# Altium schematic sheet schematic.schdoc
size 307 x 218 mm; Symbol: Drawing-Symbol_A4; Device: Drawing-Symbol_A4; Company: 嘉立创EDA; Version: V1.0; Page Size: A4; @Project Name: 微型显示器-401RCT6; @Page Count: 1; @Update Date: 2025-12-23; @Create Date: 2025-12-08; @Schematic Name: Schematic1; @Page No: 1; @Page Name: P1; @Board Name: Board1; @Create Time: 16:00:11; @Update Time: 19:46:00; Title Block Position: 3; Size: A4; Width: 1170; Height: 825; Region Start: 1; X Region Count: 6; Y Region Count: 4; Blade Width: 10
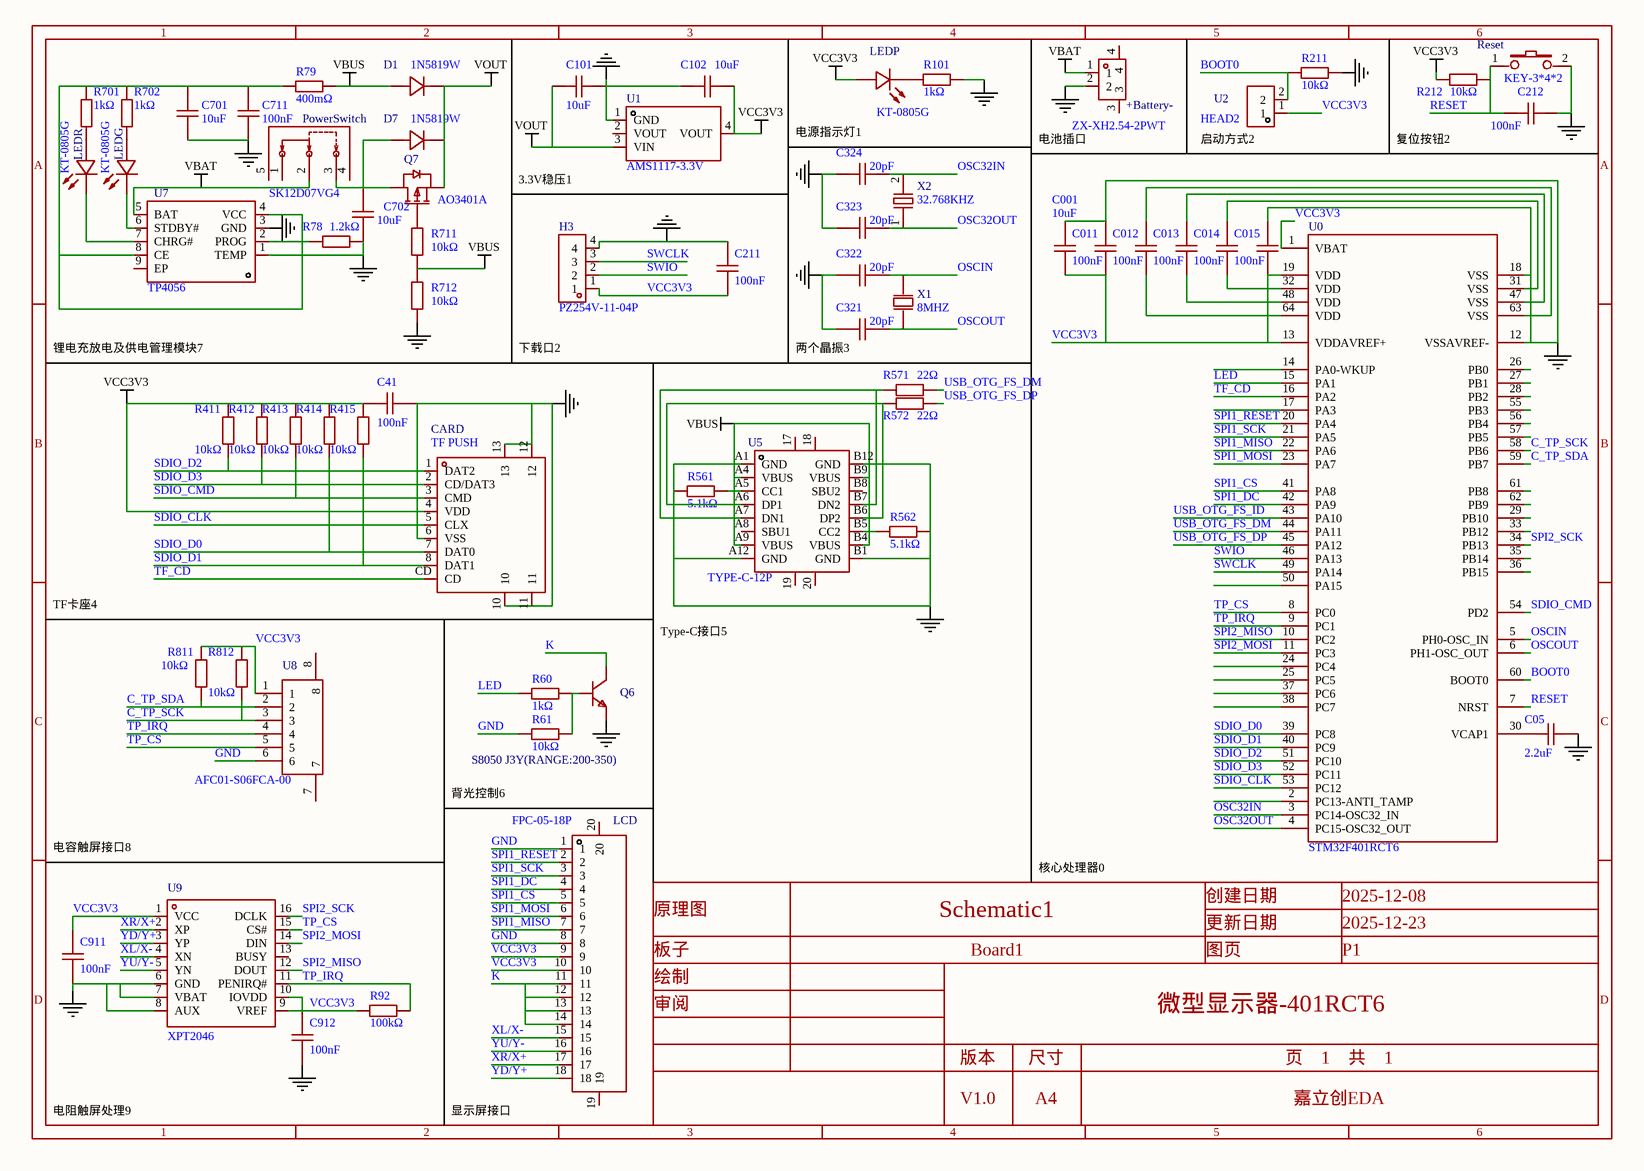
[diagram p0: schematic.schdoc]

## Parts
+Battery-  ZX-XH2.54-2PWT  [CONN-SMD_2P-P2.54_MEGASTAR_ZX-XH2.54-2PWT]
C001  10uF  [C0603]
C05  2.2uF  [C0603]
C011  100nF  [C0603]
C012  100nF  [C0603]
C013  100nF  [C0603]
C014  100nF  [C0603]
C015  100nF  [C0603]
C41  100nF  [C0603]
C101  10uF  [C0603]
C102  10uF  [C0603]
C211  100nF  [C0603]
C212  100nF  [C0603]
C321  20pF  [C0603]
C322  20pF  [C0603]
C323  20pF  [C0603]
C324  20pF  [C0603]
C701  10uF  [C0603]
C702  10uF  [C0603]
C711  100nF  [C0603]
C911  100nF  [C0603]
C912  100nF  [C0603]
CARD  TF PUSH  [TF-SMD_TF-PUSH]
D1  1N5819W  [SOD-123_L2.7-W1.6-LS3.7-FD]
D7  1N5819W  [SOD-123_L2.7-W1.6-LS3.7-FD]
H3  PZ254V-11-04P  [HDR-TH_4P-P2.54-V-M]
LCD  FPC-05-18P  [FPC-SMD_18P-P0.50_XW05200-18]
LEDG  KT-0805G  [LED0805-R-RD]
LEDP  KT-0805G  [LED0805-R-RD]
LEDR  KT-0805G  [LED0805-R-RD]
PowerSwitch  SK12D07VG4  [SW-TH_SK12D07VG4]
Q6  S8050 J3Y(RANGE:200-350)  [SOT-23-3_L3.0-W1.7-P0.95-LS2.9-BR]
Q7  AO3401A  [SOT-23_L2.9-W1.3-P1.90-LS2.4-BR]
R60  1kΩ  [R0603]
R61  10kΩ  [R0603]
R78  1.2kΩ  [R0603]
R79  400mΩ  [R0603]
R92  100kΩ  [R0603]
R101  1kΩ  [R0603]
R211  10kΩ  [R0603]
R212  10kΩ  [R0603]
R411  10kΩ  [R0603]
R412  10kΩ  [R0603]
R413  10kΩ  [R0603]
R414  10kΩ  [R0603]
R415  10kΩ  [R0603]
R561  5.1kΩ  [R0603]
R562  5.1kΩ  [R0603]
R571  22Ω  [R0603]
R572  22Ω  [R0603]
R701  1kΩ  [R0603]
R702  1kΩ  [R0603]
R711  10kΩ  [R0603]
R712  10kΩ  [R0603]
R811  10kΩ  [R0603]
R812  10kΩ  [R0603]
Reset  KEY-3*4*2  [SW-SMD_L4.0-W2.9-LS5.0]
U0  STM32F401RCT6  [LQFP-64_L10.0-W10.0-P0.50-LS12.0-BL]
U1  AMS1117-3.3V  [SOT-223-3_L6.5-W3.4-P2.30-LS7.0-BR]
U2  HEAD2  [HDR-TH_2P-P2.54-V-M]
U5  TYPE-C-12P  [USB-SMD_TYPE-C16PIN]
U7  TP4056  [ESOP-8_L4.9-W3.9-P1.27-LS6.0-BL-EP3.1]
U8  AFC01-S06FCA-00  [FPC-SMD_P0.50-6P_AFC01-S06FCA-00]
U9  XPT2046  [TSSOP-16_L5.0-W4.4-P0.65-LS6.4-BL]
X1  8MHZ  [HC-49S_L11.5-W5.0-P4.88]
X2  32.768KHZ  [CRYSTAL-SMD_L3.2-W1.5-1]

## Nets
GND: +Battery-.2 C001.2 C05.1 C011.2 C012.2 C013.1 C014.2 C015.2 C41.2 C101.2 C102.1 C211.2 C212.2 C321.1 C322.1 C323.1 C324.1 C701.1 C702.1 C711.1 C911.1 C912.1 CARD.6(VSS) CARD.10 CARD.11 CARD.12 CARD.13 H3.4 LCD.1 LCD.8 Q6.2(E) R61.2 R78.2 R101.2 R211.2 R561.1 R562.2 R712.1 Reset.2 U0.12(VSSAVREF-) U0.18(VSS) U0.31(VSS) U0.47(VSS) U0.63(VSS) U1.1(GND) U5.A1(GND) U5.A12(GND) U5.B1(GND) U5.B12(GND) U7.1(TEMP) U7.3(GND) U8.6 U9.6(GND) U9.7(VBAT) U9.8(AUX)
VBAT: +Battery-.1 PowerSwitch.2 U7.5(BAT)
VBUS: D1.2(A) R79.2 R711.1 R712.2 U5.A4(VBUS) U5.A9(VBUS) U5.B4(VBUS) U5.B9(VBUS)
VCC3V3: C001.1 C011.1 C012.1 C013.2 C014.1 C015.1 C41.1 C102.2 C211.1 C911.2 C912.2 CARD.4(VDD) H3.1 LCD.9 LCD.10 LEDP.1(A) R92.2 R212.1 R411.2 R412.2 R413.2 R414.2 R415.2 R811.2 R812.2 U0.1(VBAT) U0.13(VDDAVREF+) U0.19(VDD) U0.32(VDD) U0.48(VDD) U0.64(VDD) U1.4(VOUT) U2.1 U8.1 U9.1(VCC) U9.9(VREF) U9.10(IOVDD)
VOUT: C101.1 D1.1(K) D7.1(K) Q7.2(S) U1.3(VIN)
BOOT0: R211.1 U0.60(BOOT0) U2.2
C_TP_SCK: R812.1 U0.58(PB6) U8.3
C_TP_SDA: R811.1 U0.59(PB7) U8.2
K: LCD.11 LCD.12 LCD.13 LCD.14 Q6.3(C)
LED: R60.2 U0.15(PA1)
OSC32IN: C324.2 U0.3(PC14-OSC32_IN) X2.2
OSC32OUT: C323.2 U0.4(PC15-OSC32_OUT) X2.1
OSCIN: C322.2 U0.5(PH0-OSC_IN) X1.2(OSC2)
OSCOUT: C321.2 U0.6(PH1-OSC_OUT) X1.1(OSC1)
RESET: C212.1 R212.2 Reset.1 U0.7(NRST)
SDIO_CLK: CARD.5(CLX) U0.53(PC12)
SDIO_CMD: CARD.3(CMD) R413.1 U0.54(PD2)
SDIO_D0: CARD.7(DAT0) R414.1 U0.39(PC8)
SDIO_D1: CARD.8(DAT1) R415.1 U0.40(PC9)
SDIO_D2: CARD.1(DAT2) R411.1 U0.51(PC10)
SDIO_D3: CARD.2(CD/DAT3) R412.1 U0.52(PC11)
SPI1_CS: LCD.5 U0.41(PA8)
SPI1_DC: LCD.4 U0.42(PA9)
SPI1_MISO: LCD.7 U0.22(PA6)
SPI1_MOSI: LCD.6 U0.23(PA7)
SPI1_RESET: LCD.2 U0.20(PA4)
SPI1_SCK: LCD.3 U0.21(PA5)
SPI2_MISO: U0.10(PC2) U9.12(DOUT)
SPI2_MOSI: U0.11(PC3) U9.14(DIN)
SPI2_SCK: U0.34(PB13) U9.16(DCLK)
SWCLK: H3.3 U0.49(PA14)
SWIO: H3.2 U0.46(PA13)
TF_CD: CARD.CD U0.16(PA2)
TP_CS: U0.8(PC0) U8.5 U9.15(CS#)
TP_IRQ: R92.1 U0.9(PC1) U8.4 U9.11(PENIRQ#)
USB_OTG_FS_DM: R571.2 U0.44(PA11)
USB_OTG_FS_DP: R572.2 U0.45(PA12)
USB_OTG_FS_ID: U0.43(PA10)
XL/X-: LCD.15 U9.4(XN)
XR/X+: LCD.17 U9.2(XP)
YD/Y+: LCD.18 U9.3(YP)
YU/Y-: LCD.16 U9.5(YN)
NetC05_2: C05.2 U0.30(VCAP1)
NetC701_2: C701.2 C711.2 R79.1 R701.2 R702.2 U7.4(VCC) U7.8(CE)
NetC702_2: C702.2 D7.2(A) PowerSwitch.3 Q7.3(D)
NetLEDG_1: LEDG.1(A) R702.1
NetLEDG_2: LEDG.2(K) U7.6(STDBY#)
NetLEDP_2: LEDP.2(K) R101.1
NetLEDR_1: LEDR.1(A) R701.1
NetLEDR_2: LEDR.2(K) U7.7(CHRG#)
NetQ6_1: Q6.1(B) R60.1 R61.1
NetQ7_1: Q7.1(G) R711.2
NetR78_1: R78.1 U7.2(PROG)
NetR561_2: R561.2 U5.A5(CC1)
NetR562_1: R562.1 U5.B5(CC2)
NetR571_1: R571.1 U5.A7(DN1) U5.B7(DN2)
NetR572_1: R572.1 U5.A6(DP1) U5.B6(DP2)

Not connected (* = marked no-connect by the designer): +Battery- 3 4; LCD 19 20; PowerSwitch 1 4 5; U0 2(PC13-ANTI_TAMP) 14(PA0-WKUP) 17(PA3) 24(PC4) 25(PC5) 26(PB0) 27(PB1) 28(PB2) 29(PB10) 33(PB12) 35(PB14) 36(PB15) 37(PC6) 38(PC7) 50(PA15) 55(PB3) 56(PB4) 57(PB5) 61(PB8) 62(PB9); U1 2(VOUT); U5 17 18 19 20 A8(SBU1) B8(SBU2); U7 9(EP); U8 7 8; U9 13(BUSY)

## Notes on the sheet
- (near C324) 电源指示灯1
- (near +Battery-) 电池插口
- (near U2) 启动方式2
- 复位按钮2
- 3.3V稳压1
- 锂电充放电及供电管理模块7
- 下载口2
- (near C321) 两个晶振3
- TF卡座4
- Type-C接口5
- 电容触屏接口8
- 背光控制6
- 核心处理器0
- 电阻触屏处理9
- 显示屏接口
- 1
- 2
- 3
- 4
- 5
- 6
- A
- B
- C
- 原理图
- Schematic1
- 创建日期
- 更新日期
- 2025-12-08
- 2025-12-23
- 板子
- 绘制
- Board1
- 图页
- P1
- D
- 审阅
- 版本
- 尺寸
- 微型显示器-401RCT6
- 页    1    共    1
- V1.0
- A4
- 嘉立创EDA

## Library data of the parts
+Battery- = ZX-XH2.54-2PWT: Manufacturer: Megastar(兆星); Add into BOM: yes; Pins Structure: 1x2P; Pitch: 2.5mm; Reference Series: XH; Number of PINs Per Row: 2; Current Rating: 3A; Voltage Rating: 250V; Supplementary Features: 辅助焊脚; Z-Height of the Board: 6.2mm; X-Length of Bottom Edge on Board (Spacing Line): 10mm; Y-Width of Bottom Edge on Board: 10.5mm; Symbol: ZX-XH2.54-2PWT; Device: ZX-XH2.54-2PWT; LCSC Part Name: 1x2P 间距:2.5mm 卧贴 系列:XH; Supplier Part: C7429671; Manufacturer Part: ZX-XH2.54-2PWT; Supplier Footprint: SMD,P=2.5mm,卧贴; JLCPCB Part Class: 扩展库; Datasheet: https://item.szlcsc.com/datasheet/ZX-XH2.54-2PWT/8427588.html; Supplier: LCSC; Convert to PCB: yes; Mounting Type: 卧贴; Number of Pins: 2P; Number of Rows: 1; Row Spacing: -; Contact Material: 黄铜; Contact Plating: 锡; Operating Temperature: -25℃~+85℃; Plastic Material: -; Flame Retardant Rating: -; Color: 米色
C001 C701 = CGA0603X5R106K100JT: Manufacturer: HRE(芯声); Symbol: Capacitance; Add into BOM: yes; Tolerance: ±10%; Voltage Rating: 10V; Temperature Coefficient: X5R; Channel ID: $1e1874; Device: CGA0603X5R106K100JT; LCSC Part Name: 10uF ±10% 10V; Supplier Part: C6119842; Manufacturer Part: CGA0603X5R106K100JT; Supplier Footprint: 0603; JLCPCB Part Class: Extended Part; Supplier: LCSC; Convert to PCB: yes; Value: 10uF; FootprintName: C0603; DeviceName: CGA0603X5R106K100JT
C05 = CL10A225KO8NNNC: Manufacturer: SAMSUNG(三星); Symbol: Capacitance; Add into BOM: yes; Tolerance: ±10%; Voltage Rating: 16V; Temperature Coefficient: X5R; Device: CL10A225KO8NNNC; LCSC Part Name: 2.2uF ±10% 16V; Supplier Part: C23630; Manufacturer Part: CL10A225KO8NNNC; Supplier Footprint: 0603; JLCPCB Part Class: Basic Part; Datasheet: https://item.szlcsc.com/datasheet/CL10A225KO8NNNC/24366.html; Supplier: LCSC; Convert to PCB: yes; Value: 2.2uF
C011 C012 C013 C014 C015 C41 C211 C212 C711 C911 C912 = CGA0603X7R104K500JT: Manufacturer: HRE(芯声); Symbol: Capacitance; Add into BOM: yes; Tolerance: ±10%; Voltage Rating: 50V; Temperature Coefficient: X7R; Device: CGA0603X7R104K500JT; LCSC Part Name: 100nF ±10% 50V; Supplier Part: C6119867; Manufacturer Part: CGA0603X7R104K500JT; Supplier Footprint: 0603; JLCPCB Part Class: Extended Part; Datasheet: https://atta.szlcsc.com/upload/public/pdf/source/20250103/C44077DA9E7B3EFAE02F22B6D3D1CBC9.pdf; Supplier: LCSC; Convert to PCB: yes; Value: 100nF
C101 = CGA0603X5R106K100JT: Manufacturer: HRE(芯声); Symbol: Capacitance; Add into BOM: yes; Tolerance: ±10%; Voltage Rating: 10V; Temperature Coefficient: X5R; Channel ID: $1e4207; Device: CGA0603X5R106K100JT; LCSC Part Name: 10uF ±10% 10V; Supplier Part: C6119842; Manufacturer Part: CGA0603X5R106K100JT; Supplier Footprint: 0603; JLCPCB Part Class: Extended Part; Supplier: LCSC; Convert to PCB: yes; Value: 10uF; FootprintName: C0603; DeviceName: CGA0603X5R106K100JT
C102 = CGA0603X5R106K100JT: Manufacturer: HRE(芯声); Symbol: Capacitance; Add into BOM: yes; Tolerance: ±10%; Voltage Rating: 10V; Temperature Coefficient: X5R; Channel ID: $1e4183; Device: CGA0603X5R106K100JT; LCSC Part Name: 10uF ±10% 10V; Supplier Part: C6119842; Manufacturer Part: CGA0603X5R106K100JT; Supplier Footprint: 0603; JLCPCB Part Class: Extended Part; Supplier: LCSC; Convert to PCB: yes; Value: 10uF; FootprintName: C0603; DeviceName: CGA0603X5R106K100JT
C321 = CC0603JRNPO9BN200: Manufacturer: YAGEO(国巨); Symbol: Capacitance; Add into BOM: yes; Tolerance: ±5%; Voltage Rated: 50V; Temperature Coefficient: NP0; Channel ID: $1e6628; Device: CC0603JRNPO9BN200; LCSC Part Name: 20pF ±5% 50V; Supplier Part: C105621; Manufacturer Part: CC0603JRNPO9BN200; Supplier Footprint: 0603; JLCPCB Part Class: Extended Part; Datasheet: https://atta.szlcsc.com/upload/public/pdf/source/20170505/1493957838062.pdf; Supplier: LCSC; Convert to PCB: yes; Value: 20pF; FootprintName: C0603; DeviceName: CC0603JRNPO9BN200
C322 = CC0603JRNPO9BN200: Manufacturer: YAGEO(国巨); Symbol: Capacitance; Add into BOM: yes; Tolerance: ±5%; Voltage Rated: 50V; Temperature Coefficient: NP0; Channel ID: $1e6574; Device: CC0603JRNPO9BN200; LCSC Part Name: 20pF ±5% 50V; Supplier Part: C105621; Manufacturer Part: CC0603JRNPO9BN200; Supplier Footprint: 0603; JLCPCB Part Class: Extended Part; Datasheet: https://atta.szlcsc.com/upload/public/pdf/source/20170505/1493957838062.pdf; Supplier: LCSC; Convert to PCB: yes; Value: 20pF; FootprintName: C0603; DeviceName: CC0603JRNPO9BN200
C323 = CC0603JRNPO9BN200: Manufacturer: YAGEO(国巨); Symbol: Capacitance; Add into BOM: yes; Tolerance: ±5%; Voltage Rated: 50V; Temperature Coefficient: NP0; Channel ID: $1e6277; Device: CC0603JRNPO9BN200; LCSC Part Name: 20pF ±5% 50V; Supplier Part: C105621; Manufacturer Part: CC0603JRNPO9BN200; Supplier Footprint: 0603; JLCPCB Part Class: Extended Part; Datasheet: https://atta.szlcsc.com/upload/public/pdf/source/20170505/1493957838062.pdf; Supplier: LCSC; Convert to PCB: yes; Value: 20pF; FootprintName: C0603; DeviceName: CC0603JRNPO9BN200
C324 = CC0603JRNPO9BN200: Manufacturer: YAGEO(国巨); Symbol: Capacitance; Add into BOM: yes; Tolerance: ±5%; Voltage Rated: 50V; Temperature Coefficient: NP0; Channel ID: $1e6253; Device: CC0603JRNPO9BN200; LCSC Part Name: 20pF ±5% 50V; Supplier Part: C105621; Manufacturer Part: CC0603JRNPO9BN200; Supplier Footprint: 0603; JLCPCB Part Class: Extended Part; Datasheet: https://atta.szlcsc.com/upload/public/pdf/source/20170505/1493957838062.pdf; Supplier: LCSC; Convert to PCB: yes; Value: 20pF; FootprintName: C0603; DeviceName: CC0603JRNPO9BN200
C702 = CGA0603X5R106K100JT: Manufacturer: HRE(芯声); Symbol: Capacitance; Add into BOM: yes; Tolerance: ±10%; Voltage Rating: 10V; Temperature Coefficient: X5R; Channel ID: $1e1609; Device: CGA0603X5R106K100JT; LCSC Part Name: 10uF ±10% 10V; Supplier Part: C6119842; Manufacturer Part: CGA0603X5R106K100JT; Supplier Footprint: 0603; JLCPCB Part Class: Extended Part; Supplier: LCSC; Convert to PCB: yes; Value: 10uF; FootprintName: C0603; DeviceName: CGA0603X5R106K100JT
CARD = TF PUSH: Manufacturer: SHOU HAN(首韩); Add into BOM: yes; Card Connection Mode: 自弹式; Card Type: MicroSD卡(TF卡); Connector Type: 卡座; Additional Card Detection Pins: 无; Symbol: TF PUSH; Device: TF PUSH; LCSC Part Name: 自弹式 MicroSD卡(TF卡) 卡座; Supplier Part: C393941; Manufacturer Part: TF PUSH; Supplier Footprint: SMD; JLCPCB Part Class: 扩展库; Datasheet: https://item.szlcsc.com/datasheet/TF%2520PUSH/372553.html; Supplier: LCSC; Convert to PCB: yes; Supplementary Features: -; Height Above Board: 2mm; Operating Temperature: -25℃~+90℃
D1 D7 = 1N5819W_C5451628: Manufacturer: HXY MOSFET(华轩阳电子); Symbol: 1N4007_C9900004759; Add into BOM: yes; Diode Configuration: 独立式; Voltage - Forward(Vf@If): 600mV@200mA; Voltage - DC Reverse(Vr): 40V; Current - Rectified: 350mA; Reverse Leakage Current (Ir): 5uA@30V; Device: 1N5819W_C5451628; LCSC Part Name: 电压:40V 电流:350mA; Supplier Part: C5451628; Manufacturer Part: 1N5819W; Supplier Footprint: SOD-123; JLCPCB Part Class: Extended Part; Datasheet: https://item.szlcsc.com/datasheet/1N5819W/6355371.html; Supplier: LCSC; Convert to PCB: yes
H3 = PZ254V-11-04P_C492403: Manufacturer: XFCN(兴飞); Add into BOM: yes; Pin Structure: 1x4P; Pitch: 2.54mm; Circluar Pins/Square Pins: 方针; Symbol: PZ254V-11-04P; Device: PZ254V-11-04P_C492403; LCSC Part Name: 1x4P 间距:2.54mm 方针 直插; Supplier Part: C492403; Manufacturer Part: PZ254V-11-04P; Supplier Footprint: 插件,P=2.54mm; JLCPCB Part Class: Extended Part; Datasheet: https://atta.szlcsc.com/upload/public/pdf/source/20200309/C492403_F9F19131791D08044AD4F84F8E751A34.pdf; Supplier: LCSC; Convert to PCB: yes; Row Spacing: -; Mounting Type: 直插; Number of Rows: 单排; Number of Pins: 4P; Current Rating: -; Voltage Rating (Max): -; Length of Mating Pin: 6mm; Insulation Height: 2.5mm; Length of End Connection Pin: 3mm; Contact Material: 黄铜; Contact Plating: -; Operating Temperature: -40℃~+105℃; Color: 黑色
LCD = FPC-05-18P: Add into BOM: yes; Symbol: FPC-05-18P; Device: FPC-05-18P; LCSC Part Name: FPC-05-18P; Supplier Part: C9900014287; Manufacturer Part: FPC-05-18P; Supplier Footprint: FPC-05-18P; JLCPCB Part Class: Extended Part; Supplier: LCSC; Convert to PCB: yes
LEDG LEDP LEDR = KT-0805G: Manufacturer: KENTO; Symbol: 0805G (Green); Add into BOM: yes; Illumination Color: 翠绿色; Voltage - Forward(Vf): 2.6V~3.1V; Power(Watts): 100mW; Forward Current: 5mA; Wavelength - Dominant: 513nm~528nm; Peak Wavelength: 525nm; Luminous Intensity: 430mcd; Viewing Angle: 120°; Device: KT-0805G; LCSC Part Name: 0805 翠绿 高亮; Supplier Part: C2297; Manufacturer Part: KT-0805G; Supplier Footprint: 0805; JLCPCB Part Class: 基础库; Datasheet: https://item.szlcsc.com/datasheet/KT-0805G/2670.html; Supplier: LCSC; Convert to PCB: yes; Lamp Holder Type: -; Diode Configuration: -; Lens Color: -; Color Temperature: -; Mounting Style: -; Operating Temperature: -40℃~+85℃
PowerSwitch = SK12D07VG4: Manufacturer: SHOU HAN(首韩); Add into BOM: yes; Circuit: 单刀双掷; Actuator Style: 矩形柱状; Switch Height: 8.8mm; Current Rating: 500mA; Voltage Rating: 50V; Life: 5千次; Channel ID: $1e20535; Symbol: SK12D07VG4; Device: SK12D07VG4; LCSC Part Name: 3脚2档位 卧插 滑动开关; Supplier Part: C393937; Manufacturer Part: SK12D07VG4; Supplier Footprint: 插件; JLCPCB Part Class: 扩展库; Datasheet: https://item.szlcsc.com/datasheet/SK12D07VG4/372549.html; Supplier: LCSC; Convert to PCB: yes; Termination Style: PC引脚; Mounting Type: -; Operating Temperature: -; Length: 8.7mm; FootprintName: SW-TH_SK12D07VG4; DeviceName: SK12D07VG4
Q6 = S8050 J3Y(RANGE:200-350): Manufacturer: CJ(江苏长电/长晶); Symbol: S8050_C2146; Add into BOM: yes; type: NPN; Current - Collector(Ic): 500mA; Collector - Emitter Voltage VCEO: 25V; Pd - Power Dissipation: 300mW; DC Current Gain: 200@500mA,1V; Transition frequency(fT): 150MHz; Current - Collector Cutoff: 100nA; Vce Saturation(VCE(sat)): 600mV@500mA,50mA; Emitter-Base Voltage(Vebo): 5V; Number: 1个NPN; Device: S8050 J3Y(RANGE:200-350); LCSC Part Name: H档(200-350) NPN 电流:0.5A 电压:25V; Supplier Part: C2146; Manufacturer Part: S8050 J3Y(RANGE:200-350); Supplier Footprint: SOT-23; JLCPCB Part Class: 基础库; Datasheet: https://item.szlcsc.com/datasheet/S8050%2520J3Y(RANGE%253A200-350)/2503.html; Supplier: LCSC; Convert to PCB: yes; Operating Temperature: -55℃~+150℃
Q7 = AO3401A_C347476: Manufacturer: UMW(友台半导体); Add into BOM: yes; Number: 1个P沟道; Drain to Source Voltage: 30V; Current - Continuous Drain(Id): 4.2A; RDS(on): 50mΩ@10V; Pd - Power Dissipation: 1.4W; Gate Threshold Voltage (Vgs(th)): 1.3V@250uA; Gate Charge(Qg): 9.4nC@4.5V; Input Capacitance(Ciss): 954pF; Reverse Transfer Capacitance (Crss@Vds): 77pF; Type: P沟道; Output Capacitance(Coss): 115pF; Symbol: AO3401A_C347476; Device: AO3401A_C347476; LCSC Part Name: 1个P沟道 耐压:30V 电流:4.2A; Supplier Part: C347476; Manufacturer Part: AO3401A; Supplier Footprint: SOT-23; JLCPCB Part Class: 扩展库; Datasheet: https://item.szlcsc.com/datasheet/AO3401A/324136.html; Supplier: LCSC; Convert to PCB: yes; Operating Temperature: -55℃~+150℃
R60 R101 = FRC0603F1001TS: Manufacturer: FOJAN(富捷); Symbol: 电阻; Add into BOM: yes; Tolerance: ±1%; Power(Watts): 100mW; Voltage-Supply(Max): 75V; Temperature Coefficient: ±100ppm/℃; Device: FRC0603F1001TS; LCSC Part Name: 1kΩ ±1% 100mW 厚膜电阻; Supplier Part: C2907002; Manufacturer Part: FRC0603F1001TS; Supplier Footprint: 0603; JLCPCB Part Class: Extended Part; Supplier: LCSC; Convert to PCB: yes; Type: 厚膜电阻; Value: 1kΩ; Operating Temperature: -55℃~+155℃
R61 R211 R212 = RCA0310KJLF: Manufacturer: HKR(香港电阻); Symbol: 电阻; Add into BOM: yes; Tolerance: ±5%; Power(Watts): 100mW; Device: RCA0310KJLF; LCSC Part Name: 10kΩ ±5% 100mW; Supplier Part: C22369937; Manufacturer Part: RCA0310KJLF; Supplier Footprint: 0603; JLCPCB Part Class: Extended Part; Datasheet: https://item.szlcsc.com/datasheet/RCA0310KJLF/23848968.html; Supplier: LCSC; Convert to PCB: yes; Value: 10kΩ
R78 = FRC0603J122 TS: Manufacturer: FOJAN(富捷); Symbol: 电阻; Add into BOM: yes; Tolerance: ±5%; Power(Watts): 100mW; Voltage-Supply(Max): 75V; Temperature Coefficient: ±100ppm/℃; Channel ID: $1e1633; Device: FRC0603J122 TS; LCSC Part Name: 1.2kΩ ±5% 100mW 厚膜电阻; Supplier Part: C2907081; Manufacturer Part: FRC0603J122 TS; Supplier Footprint: 0603; JLCPCB Part Class: Extended Part; Supplier: LCSC; Convert to PCB: yes; Type: 厚膜电阻; Value: 1.2kΩ; Operating Temperature: -55℃~+155℃; FootprintName: R0603; DeviceName: FRC0603J122 TS
R79 = FRL0603JR400TS: Manufacturer: FOJAN(富捷); Symbol: 电阻; Add into BOM: yes; Tolerance: ±5%; Power(Watts): 100mW; Voltage-Supply(Max): 100V; Temperature Coefficient: ±300ppm/℃; Channel ID: $1e1550; Device: FRL0603JR400TS; LCSC Part Name: 400mΩ ±5% 100mW 厚膜电阻; Supplier Part: C5126106; Manufacturer Part: FRL0603JR400TS; Supplier Footprint: 0603; JLCPCB Part Class: Extended Part; Supplier: LCSC; Convert to PCB: yes; Type: 厚膜电阻; Value: 400mΩ; Operating Temperature: -55℃~+155℃; FootprintName: R0603; DeviceName: FRL0603JR400TS
R92 = RCA03100KJLF: Manufacturer: HKR(香港电阻); Symbol: 电阻; Add into BOM: yes; Tolerance: ±5%; Power(Watts): 100mW; Voltage-Supply(Max): 75V; Temperature Coefficient: ±100ppm/℃; Device: RCA03100KJLF; LCSC Part Name: 100kΩ ±5% 100mW; Supplier Part: C22356636; Manufacturer Part: RCA03100KJLF; Supplier Footprint: 0603; JLCPCB Part Class: Extended Part; Datasheet: https://item.szlcsc.com/datasheet/RCA03100KJLF/23790080.html; Supplier: LCSC; Convert to PCB: yes; Type: 厚膜电阻; Value: 100kΩ; Operating Temperature: -55℃~+155℃
R411-R415 R712 R811 R812 = RCA0310KJLF: Manufacturer: HKR(香港电阻); Symbol: 电阻; Add into BOM: yes; Tolerance: ±5%; Power(Watts): 100mW; Channel ID: $1e1822; Voltage-Supply(Max): 75V; Temperature Coefficient: ±100ppm/℃; Device: RCA0310KJLF; LCSC Part Name: 10kΩ ±5% 100mW; Supplier Part: C22369937; Manufacturer Part: RCA0310KJLF; Supplier Footprint: 0603; JLCPCB Part Class: Extended Part; Datasheet: https://item.szlcsc.com/datasheet/RCA0310KJLF/23848968.html; Supplier: LCSC; Convert to PCB: yes; Value: 10kΩ; Type: 厚膜电阻; FootprintName: R0603; DeviceName: RCA0310KJLF
R561 R562 = 0603WAF5101T5E: Manufacturer: UNI-ROYAL(厚声); Symbol: 电阻; Add into BOM: yes; Tolerance: ±1%; Power(Watts): 100mW; Voltage-Supply(Max): 75V; Temperature Coefficient: ±100ppm/℃; Device: 0603WAF5101T5E; LCSC Part Name: 5.1kΩ ±1% 100mW 厚膜电阻; Supplier Part: C23186; Manufacturer Part: 0603WAF5101T5E; Supplier Footprint: 0603; JLCPCB Part Class: Basic Part; Datasheet: https://item.szlcsc.com/datasheet/0603WAF5101T5E/23913.html; Supplier: LCSC; Convert to PCB: yes; Type: 厚膜电阻; Value: 5.1kΩ; Operating Temperature: -55℃~+155℃
R571 R572 = 0603WAF220JT5E: Manufacturer: UNI-ROYAL(厚声); Symbol: 电阻; Add into BOM: yes; Tolerance: ±1%; Power(Watts): 100mW; Overload Voltage (Max): 75V; Temperature Coefficient: ±100ppm/℃; Device: 0603WAF220JT5E; LCSC Part Name: 22Ω ±1% 100mW 厚膜电阻; Supplier Part: C23345; Manufacturer Part: 0603WAF220JT5E; Supplier Footprint: 0603; JLCPCB Part Class: Basic Part; Datasheet: https://atta.szlcsc.com/upload/public/pdf/source/20200306/C422600_1E6D84923E4A46A82E41ADD87F860B5C.pdf; Supplier: LCSC; Convert to PCB: yes; Type: 厚膜电阻; Value: 22Ω; Operating Temperature Range: -55℃~+155℃
R701 = FRC0603F1001TS: Manufacturer: FOJAN(富捷); Symbol: 电阻; Add into BOM: yes; Tolerance: ±1%; Power(Watts): 100mW; Voltage-Supply(Max): 75V; Temperature Coefficient: ±100ppm/℃; Channel ID: $1e1968; Device: FRC0603F1001TS; LCSC Part Name: 1kΩ ±1% 100mW 厚膜电阻; Supplier Part: C2907002; Manufacturer Part: FRC0603F1001TS; Supplier Footprint: 0603; JLCPCB Part Class: Extended Part; Supplier: LCSC; Convert to PCB: yes; Type: 厚膜电阻; Value: 1kΩ; Operating Temperature: -55℃~+155℃; Overload Voltage (Max): 75V; FootprintName: R0603; DeviceName: FRC0603F1001TS
R702 = FRC0603F1001TS: Manufacturer: FOJAN(富捷); Symbol: 电阻; Add into BOM: yes; Tolerance: ±1%; Power(Watts): 100mW; Voltage-Supply(Max): 75V; Temperature Coefficient: ±100ppm/℃; Channel ID: $1e1944; Device: FRC0603F1001TS; LCSC Part Name: 1kΩ ±1% 100mW 厚膜电阻; Supplier Part: C2907002; Manufacturer Part: FRC0603F1001TS; Supplier Footprint: 0603; JLCPCB Part Class: Extended Part; Supplier: LCSC; Convert to PCB: yes; Type: 厚膜电阻; Value: 1kΩ; Operating Temperature: -55℃~+155℃; Overload Voltage (Max): 75V; FootprintName: R0603; DeviceName: FRC0603F1001TS
R711 = RCA0310KJLF: Manufacturer: HKR(香港电阻); Symbol: 电阻; Add into BOM: yes; Tolerance: ±5%; Power(Watts): 100mW; Channel ID: $1e1784; Voltage-Supply(Max): 75V; Temperature Coefficient: ±100ppm/℃; Device: RCA0310KJLF; LCSC Part Name: 10kΩ ±5% 100mW; Supplier Part: C22369937; Manufacturer Part: RCA0310KJLF; Supplier Footprint: 0603; JLCPCB Part Class: Extended Part; Datasheet: https://item.szlcsc.com/datasheet/RCA0310KJLF/23848968.html; Supplier: LCSC; Convert to PCB: yes; Value: 10kΩ; Type: 厚膜电阻; FootprintName: R0603; DeviceName: RCA0310KJLF
Reset = KEY-3*4*2: Add into BOM: yes; Symbol: KEY-3*4*2; Device: KEY-3*4*2; LCSC Part Name: KEY-3*4*2; Supplier Part: C9900015662; Manufacturer Part: KEY-3*4*2; Supplier Footprint: KEY; JLCPCB Part Class: 扩展库; Supplier: LCSC; Convert to PCB: yes
U0 = STM32F401RCT6: Manufacturer: ST(意法半导体); Add into BOM: yes; CPU Core: ARM-M4; CPU Maximum Speed: 84MHz; Program Storage Size: 256KB; Program Memory Type: FLASH; Number of I/O: 50; ADC (Bit): 12bit; Voltage - Supply: 1.7V~3.6V; Symbol: STM32F401RCT6; Device: STM32F401RCT6; LCSC Part Name: 带DSP和FPU的高性能基本型系列ARM Cortex-M4 MCU，具有256 KB Flash、84 MHz CPU和ART加速器; Supplier Part: C74524; Manufacturer Part: STM32F401RCT6; Supplier Footprint: LQFP-64(10x10); JLCPCB Part Class: 扩展库; Datasheet: https://item.szlcsc.com/datasheet/STM32F401RCT6/75646.html; Supplier: LCSC; Convert to PCB: yes; Applications: -
U1 = AMS1117-3.3V_C5205141: Manufacturer: JSMSEMI(杰盛微); Add into BOM: yes; Output Type: 固定; Voltage - Supply: 15V; Output Voltage: 3.3V; Output Current: 1.2A; Voltage Dropout: 1.5V@(800mA); standby current: 5mA; Output Configuration: 正极; Power Supply Rejection Ratio (PSRR): 72dB@(120Hz); Number of Outputs: 1; Channel ID: $1e4021; Symbol: AMS1117-3.3; Device: AMS1117-3.3V_C5205141; LCSC Part Name: 输入18V 输出3.3V 800mA; Supplier Part: C5205141; Manufacturer Part: AMS1117-3.3V; Supplier Footprint: SOT-223; JLCPCB Part Class: Extended Part; Datasheet: https://atta.szlcsc.com/upload/public/pdf/source/20230807/E524BD9515A5B4B5F7AFDA5AFDCDAA11.pdf; Supplier: LCSC; Convert to PCB: yes; Features: 热关断; Operating Temperature: -20℃~+85℃; Noise: -; FootprintName: SOT-223-3_L6.5-W3.4-P2.30-LS7.0-BR; DeviceName: AMS1117-3.3V_C5205141
U2 = HEAD2: Add into BOM: yes; Symbol: HEAD2; Device: HEAD2; LCSC Part Name: HEAD2; Supplier Part: C9900010030; Manufacturer Part: HEAD2; Supplier Footprint: HDR-TH_2P-P2.54; JLCPCB Part Class: Extended Part; Supplier: LCSC; Convert to PCB: yes
U5 = TYPE-C-12P: Add into BOM: yes; Symbol: TYPE-C-12P; Device: TYPE-C-12P; LCSC Part Name: TYPE-C-12P; Supplier Part: C9900014866; Manufacturer Part: TYPE-C-12P; Supplier Footprint: USB_TypeC; JLCPCB Part Class: 扩展库; Supplier: LCSC; Convert to PCB: yes
U7 = TP4056_C21713961: Manufacturer: GOODWORK(固得沃克); Symbol: TP4056_C725790; Add into BOM: yes; The Chip Type: 线性充电芯片; Voltage - Supply: 4V~6.5V; Charge Current - Max: 1A; Charging Saturation Voltage: 4.2V; Type of Battery: 锂离子/聚合物; Number of Cells: 1; Device: TP4056_C21713961; LCSC Part Name: TP4056 1A 锂离子电池充电器; Supplier Part: C21713961; Manufacturer Part: TP4056; Supplier Footprint: ESOP-8; JLCPCB Part Class: Extended Part; Datasheet: https://item.szlcsc.com/datasheet/TP4056/23140154.html; Supplier: LCSC; Convert to PCB: yes; End-Off Voltage: -; Operating Temperature: -40℃~+85℃
U8 = AFC01-S06FCA-00: Manufacturer: JS(钜硕电子); Symbol: AFC24-S06FIC-00; Add into BOM: yes; Locking Feature: 翻盖式; Number of Contacts: 6P; Pitch: 0.5mm; FFC, FCB Thickness: 0.3mm; Device: AFC01-S06FCA-00; LCSC Part Name: 间距:0.5mm P数:6P 翻盖式 下接; Supplier Part: C262655; Manufacturer Part: AFC01-S06FCA-00; Supplier Footprint: SMD,P=0.5mm,卧贴; JLCPCB Part Class: Extended Part; Datasheet: https://atta.szlcsc.com/upload/public/pdf/source/20190816/C413942_2A72D1AC756EAE17EEDF756A339D4500.pdf; Supplier: LCSC; Convert to PCB: yes; Contact Type: 下接; Mounting Type: 卧贴; Height Above Board: 2mm
U9 = XPT2046: Manufacturer: XPT(矽普特); Add into BOM: yes; Symbol: XPT2046; Device: XPT2046; LCSC Part Name: XPT2046; Supplier Part: C19076; Manufacturer Part: XPT2046; Supplier Footprint: TSSOP-16; JLCPCB Part Class: 扩展库; Datasheet: https://item.szlcsc.com/datasheet/XPT2046/19779.html; Supplier: LCSC; Convert to PCB: yes; Touch Screen Type: -; Interface: -
X1 = 8MHZ: Symbol: 8MHZ_C9900021358; Add into BOM: yes; Device: 8MHZ; LCSC Part Name: 8MHZ; Supplier Part: C9900021358; Manufacturer Part: 8MHZ; Supplier Footprint: X-HC49U直插; JLCPCB Part Class: 扩展库; Supplier: LCSC; Convert to PCB: yes
X2 = 32.768KHZ: Symbol: 32.768KHZ_C9900023773; Add into BOM: yes; Device: 32.768KHZ; LCSC Part Name: 32.768KHZ; Supplier Part: C9900023773; Manufacturer Part: 32.768KHZ; Supplier Footprint: FC-135; JLCPCB Part Class: 扩展库; Supplier: LCSC; Convert to PCB: yes